# EAGLE schematic 8_bit_Left_Rev_A (EAGLE 9.6.0)

## Sheet 1 of 6: CLOCK
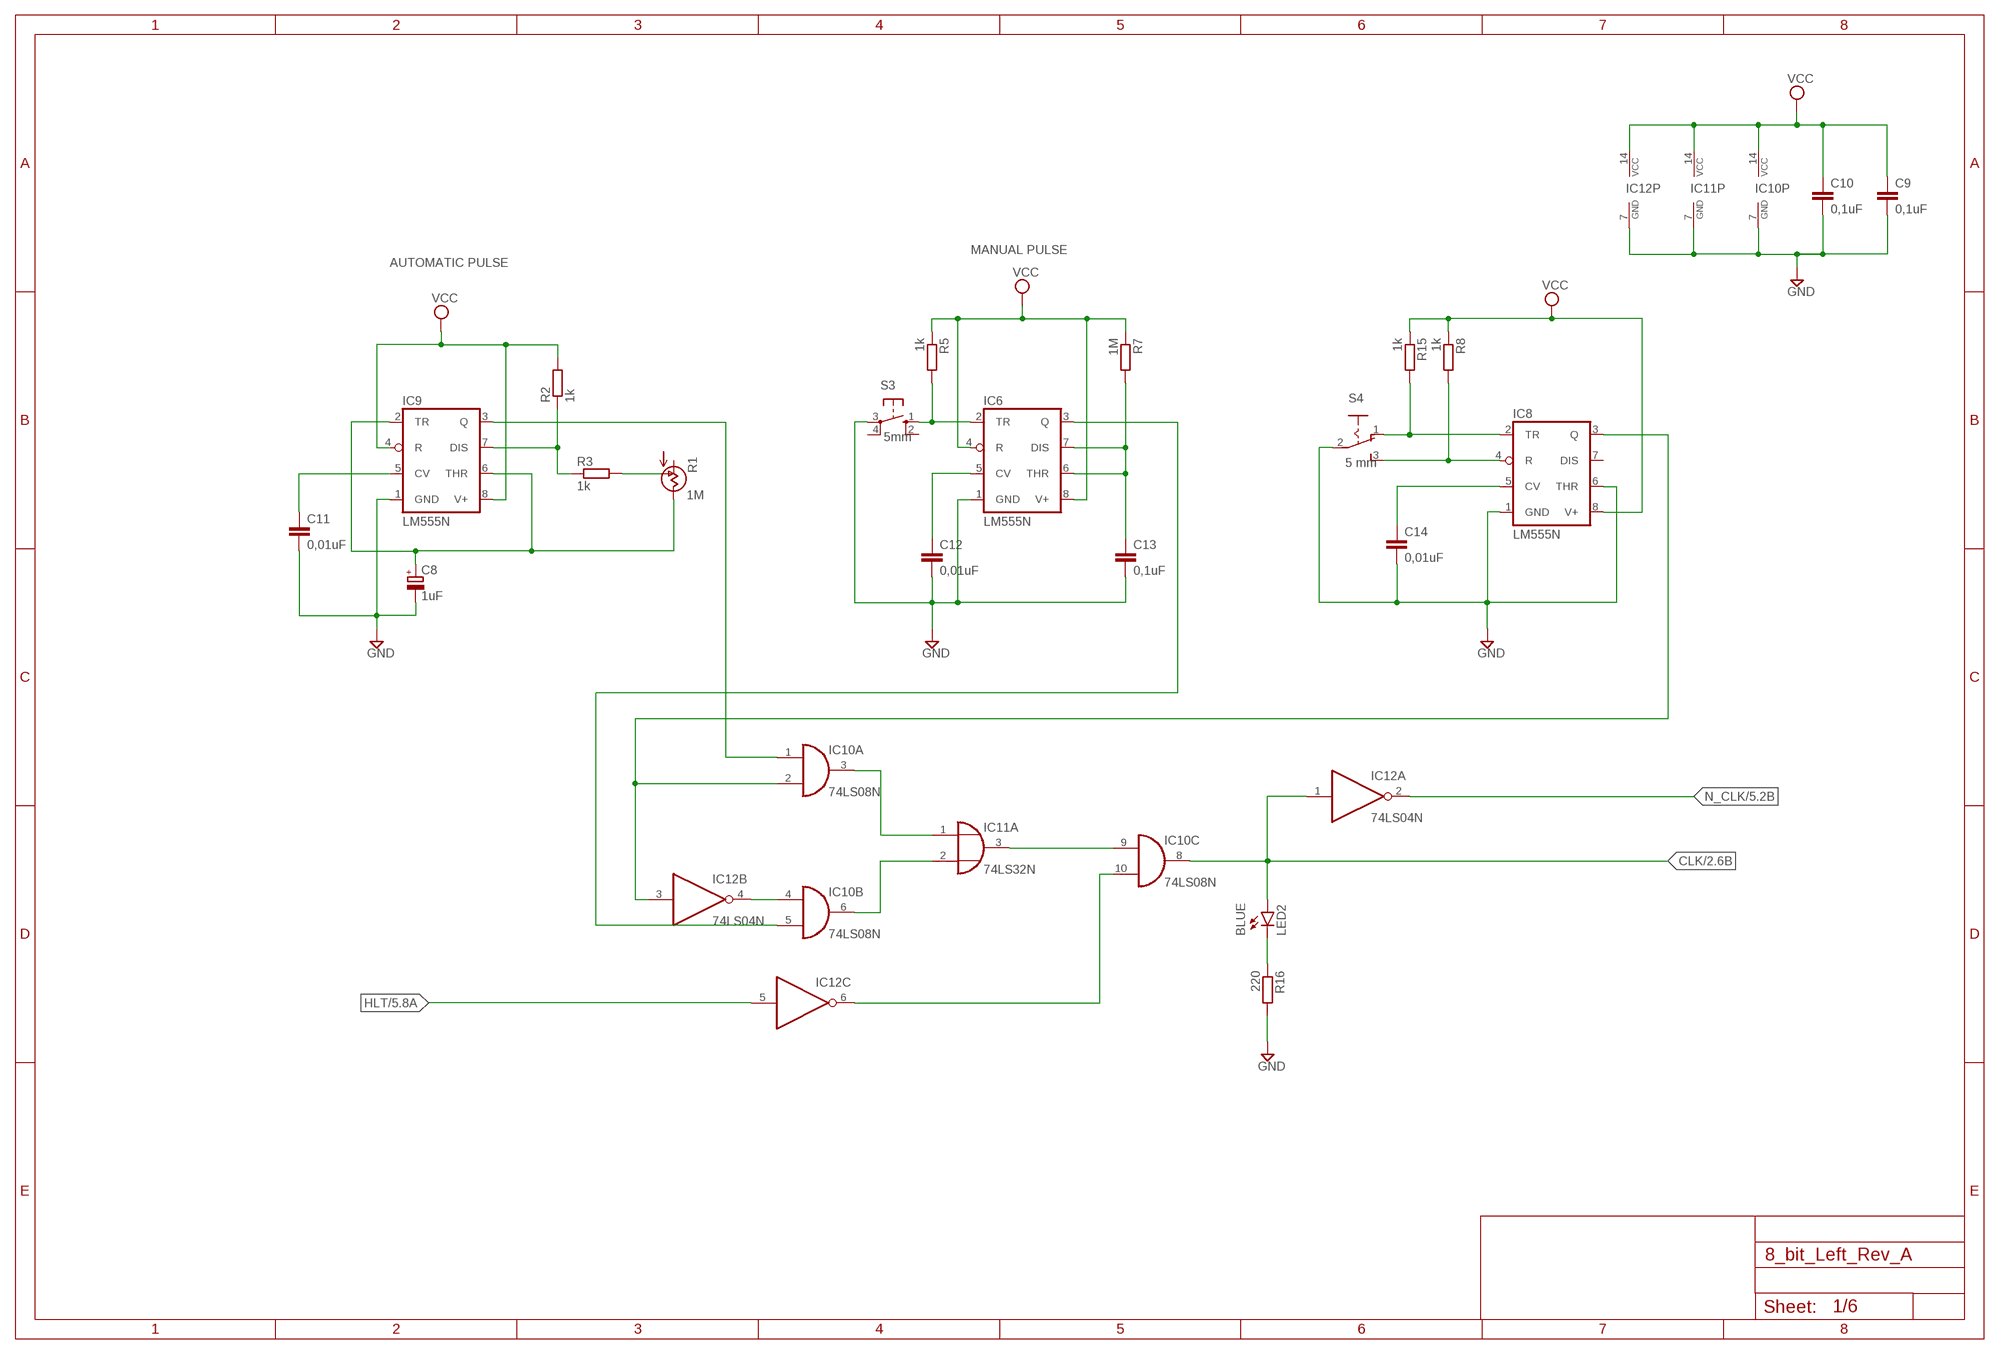
[diagram p0: schematic, sheet 1]

### Parts
C8  1uF  CPOL-EUE2-5  [E2-5]
C9  0,1uF  C-EU025-030X050  [C025-030X050]
C10  0,1uF  C-EU025-030X050  [C025-030X050]
C11  0,01uF  C-EU025-030X050  [C025-030X050]
C12  0,01uF  C-EU025-030X050  [C025-030X050]
C13  0,1uF  C-EU025-030X050  [C025-030X050]
C14  0,01uF  C-EU025-030X050  [C025-030X050]
IC6  LM555N  [DIL08]
IC8  LM555N  [DIL08]
IC9  LM555N  [DIL08]
IC10  74LS08N  [DIL14]
IC11  74LS32N  [DIL14]
IC12  74LS04N  [DIL14]
LED2  BLUE  LED5MM  [LED5MM]
R1  1M  POTTRS64W  [S64W]
R2  1k  R-EU_0207/10  [0207/10]
R3  1k  R-EU_0207/10  [0207/10]
R5  1k  R-EU_0207/10  [0207/10]
R7  1M  R-EU_0207/10  [0207/10]
R8  1k  R-EU_0207/10  [0207/10]
R15  1k  R-EU_0207/10  [0207/10]
R16  220  R-EU_0207/10  [0207/10]
S3  5mm  10-XX  [B3F-10XX]
S4  5 mm  255SB  [255SB]

### Nets
CLK: IC10.8(C:O) IC12.1(A:I) LED2.A ; also sheet 2,3,4,6
GND [zasilanie]: C8.- C9.2 C10.2 C11.2 C12.2 C13.2 C14.2 IC6.1(GND) IC8.1(GND) IC8.6(THR) IC9.1(GND) IC10.7(P:GND) IC11.7(P:GND) IC12.7(P:GND) R16.2 S3.3(P) S4.2(P) ; also sheet 2,3,4,5,6
HLT: IC12.5(C:I) ; also sheet 5
N$20: IC9.7(DIS) R2.1 R3.1
N$21: C8.+ IC9.2(TR) IC9.6(THR) R1.E(VSS)
N$22: C11.1 IC9.5(CV)
N$23: C12.1 IC6.5(CV)
N$24: C13.1 IC6.6(THR) IC6.7(DIS) R7.2
N$25: IC6.2(TR) R5.2 S3.1(S)
N$26: IC8.4(R) R8.2 S4.3(S)
N$27: IC8.2(TR) R15.2 S4.1(O)
N$28: C14.1 IC8.5(CV)
N$29: IC9.3(Q) IC10.1(A:I0)
N$30: IC6.3(Q) IC10.5(B:I1)
N$31: IC10.4(B:I0) IC12.4(B:O)
N$32: IC8.3(Q) IC10.2(A:I1) IC12.3(B:I)
N$33: IC10.3(A:O) IC11.1(A:I0)
N$34: IC10.6(B:O) IC11.2(A:I1)
N$35: IC10.9(C:I0) IC11.3(A:O)
N$36: IC10.10(C:I1) IC12.6(C:O)
N$37: R1.S(OUT) R3.2
N$38: LED2.K(C) R16.1
N_CLK: IC12.2(A:O) ; also sheet 5
VCC [zasilanie]: C9.1 C10.1 IC6.4(R) IC6.8(V+) IC8.8(V+) IC9.4(R) IC9.8(V+) IC10.14(P:VCC) IC11.14(P:VCC) IC12.14(P:VCC) R2.2 R5.1 R7.1 R8.1 R15.1 ; also sheet 2,3,4,5,6
Unconnected: IC8.7(DIS) IC10.11(D:O) IC10.12(D:I0) IC10.13(D:I1) IC11.4(B:I0) IC11.5(B:I1) IC11.6(B:O) IC11.8(C:O) IC11.9(C:I0) IC11.10(C:I1) IC11.11(D:O) IC11.12(D:I0) IC11.13(D:I1) IC12.8(D:O) IC12.9(D:I) IC12.10(E:O) IC12.11(E:I) IC12.12(F:O) IC12.13(F:I) R1.A(VDD) S3.2(S1) S3.4(P1)

### Notes on the sheet
- MANUAL PULSE
- AUTOMATIC PULSE

## Sheet 2 of 6: MAR
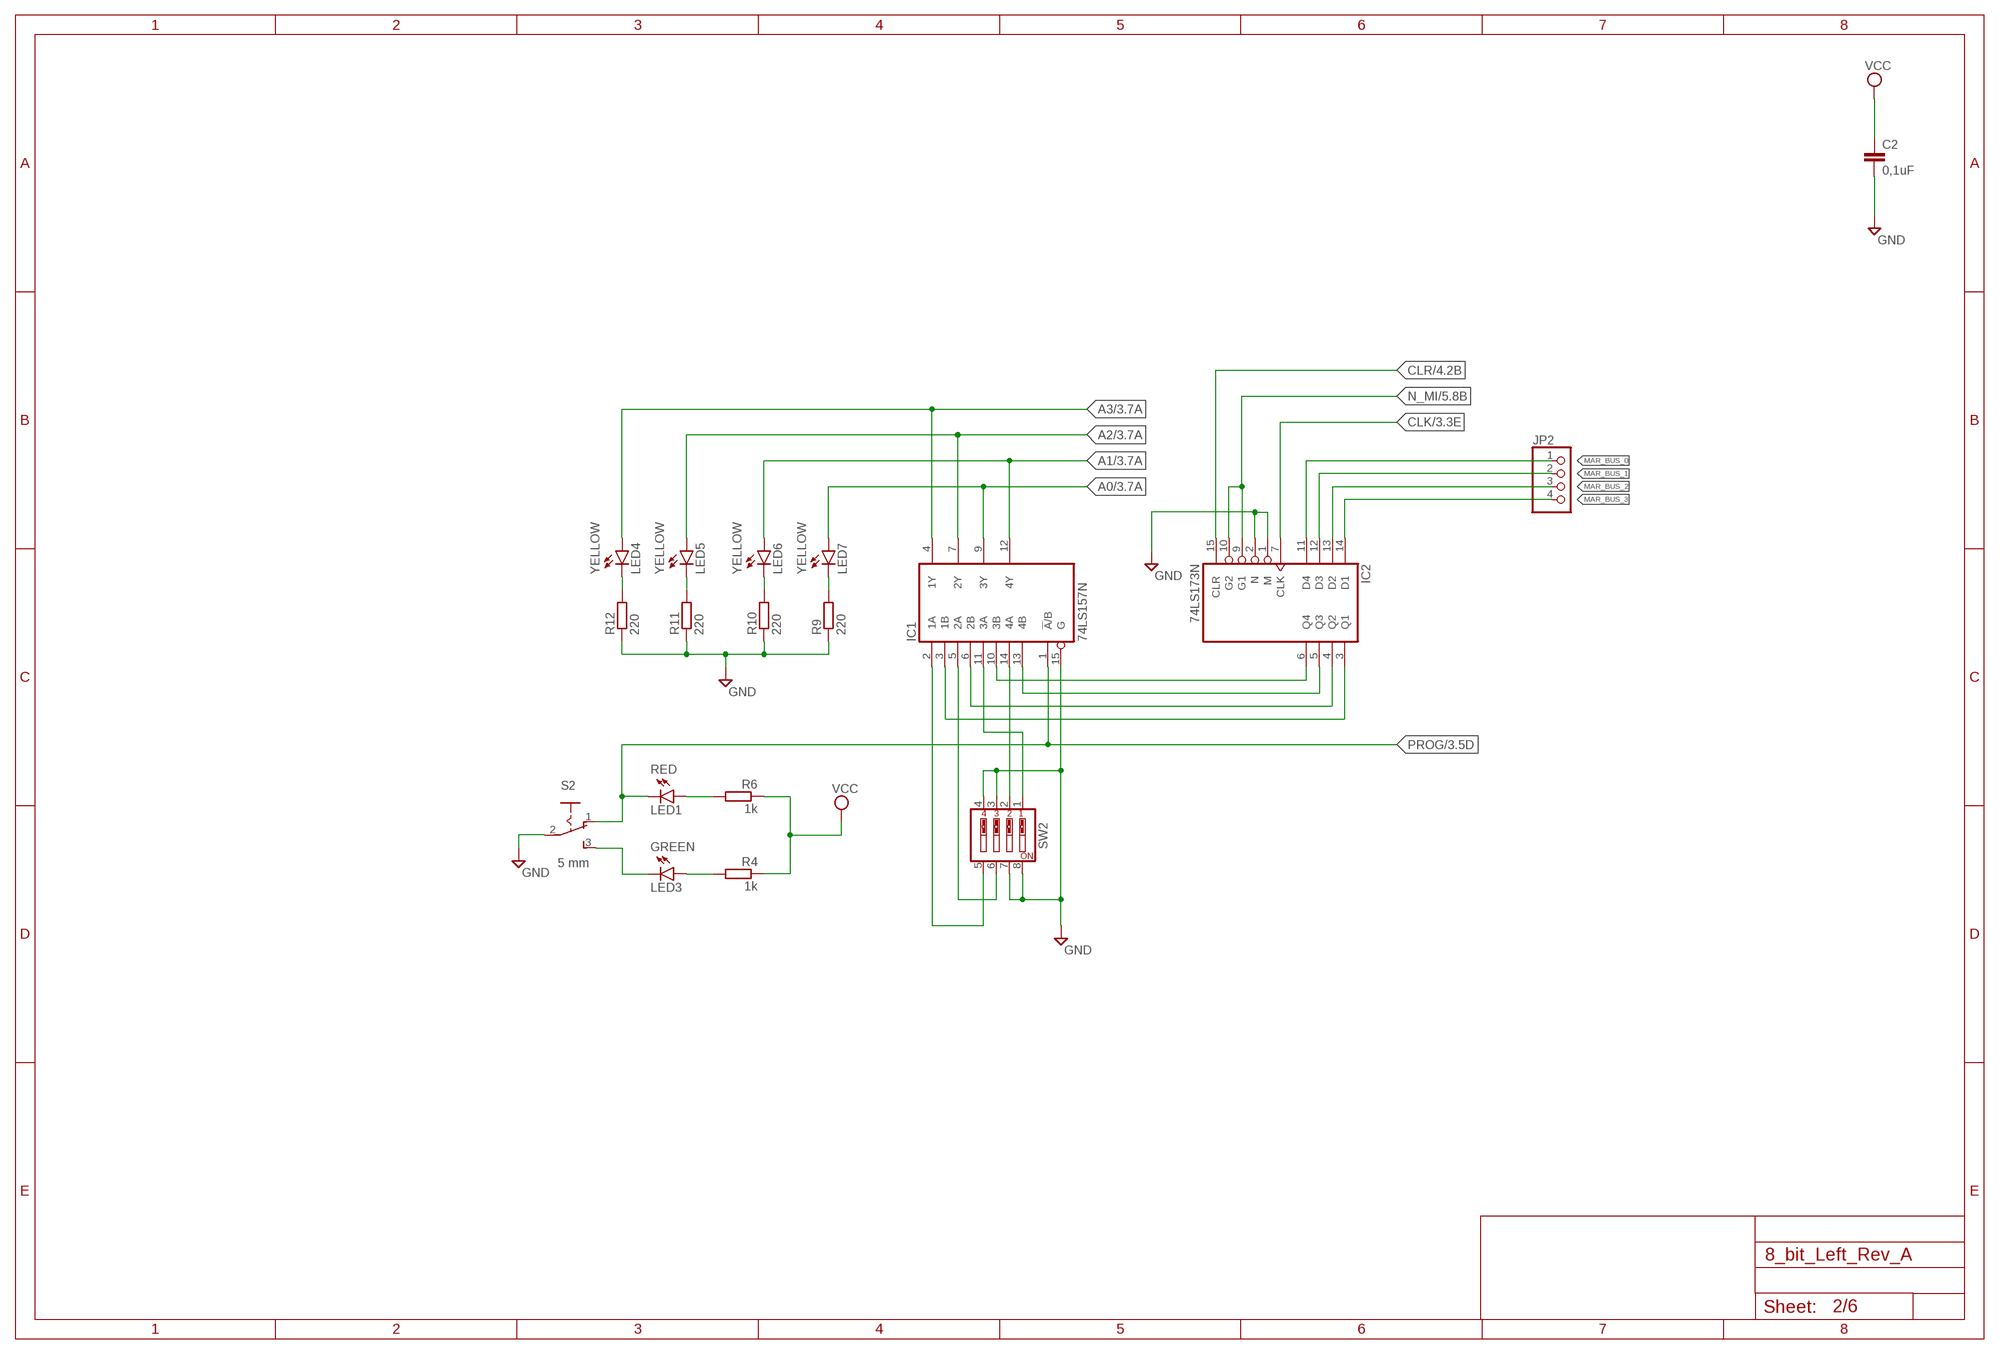
[diagram p1: schematic, sheet 2]

### Parts
C2  0,1uF  C-EU025-030X050  [C025-030X050]
IC1  74LS157N  [DIL16]
IC2  74LS173N  [DIL16]
JP2  PINHD-1X4  [1X04]
LED1  RED  LED5MM  [LED5MM]
LED3  GREEN  LED5MM  [LED5MM]
LED4  YELLOW  LED5MM  [LED5MM]
LED5  YELLOW  LED5MM  [LED5MM]
LED6  YELLOW  LED5MM  [LED5MM]
LED7  YELLOW  LED5MM  [LED5MM]
R4  1k  R-EU_0207/10  [0207/10]
R6  1k  R-EU_0207/10  [0207/10]
R9  220  R-EU_0207/10  [0207/10]
R10  220  R-EU_0207/10  [0207/10]
R11  220  R-EU_0207/10  [0207/10]
R12  220  R-EU_0207/10  [0207/10]
S2  5 mm  255SB  [255SB]
SW2  SW_DIP-4  [EDG-04]

### Nets
A0: IC1.9(3Y) LED7.A ; also sheet 3
A1: IC1.12(4Y) LED6.A ; also sheet 3
A2: IC1.7(2Y) LED5.A ; also sheet 3
A3: IC1.4(1Y) LED4.A ; also sheet 3
CLK: IC2.7(CLK) ; also sheet 1,3,4,6
CLR: IC2.15(CLR) ; also sheet 4,5
GND [zasilanie]: C2.2 IC1.15(G) IC2.1(M) IC2.2(N) R9.1 R10.1 R11.1 R12.1 S2.2(P) SW2.3 SW2.4 SW2.7 SW2.8 ; also sheet 1,3,4,5,6
GND1: LED7.K(C) R9.2
GND2: LED6.K(C) R10.2
GND3: LED5.K(C) R11.2
GND4: LED4.K(C) R12.2
MAR_BUS_0: IC2.11(D4) JP2.1
MAR_BUS_1: IC2.12(D3) JP2.2
MAR_BUS_2: IC2.13(D2) JP2.3
MAR_BUS_3: IC2.14(D1) JP2.4
N$6: LED1.A R6.2
N$7: LED3.A R4.2
N$8: LED3.K(C) S2.3(S)
N$9: IC1.14(4A) SW2.2
N$10: IC1.11(3A) SW2.1
N$11: IC1.10(3B) IC2.6(Q4)
N$12: IC1.13(4B) IC2.5(Q3)
N$13: IC1.6(2B) IC2.4(Q2)
N$14: IC1.3(1B) IC2.3(Q1)
N$15: IC1.5(2A) SW2.6
N$16: IC1.2(1A) SW2.5
N_MI: IC2.9(G1) IC2.10(G2) ; also sheet 5
PROG: IC1.1(!A!/B) LED1.K(C) S2.1(O) ; also sheet 3
VCC [zasilanie]: C2.1 R4.1 R6.1 ; also sheet 1,3,4,5,6

## Sheet 3 of 6: RAM
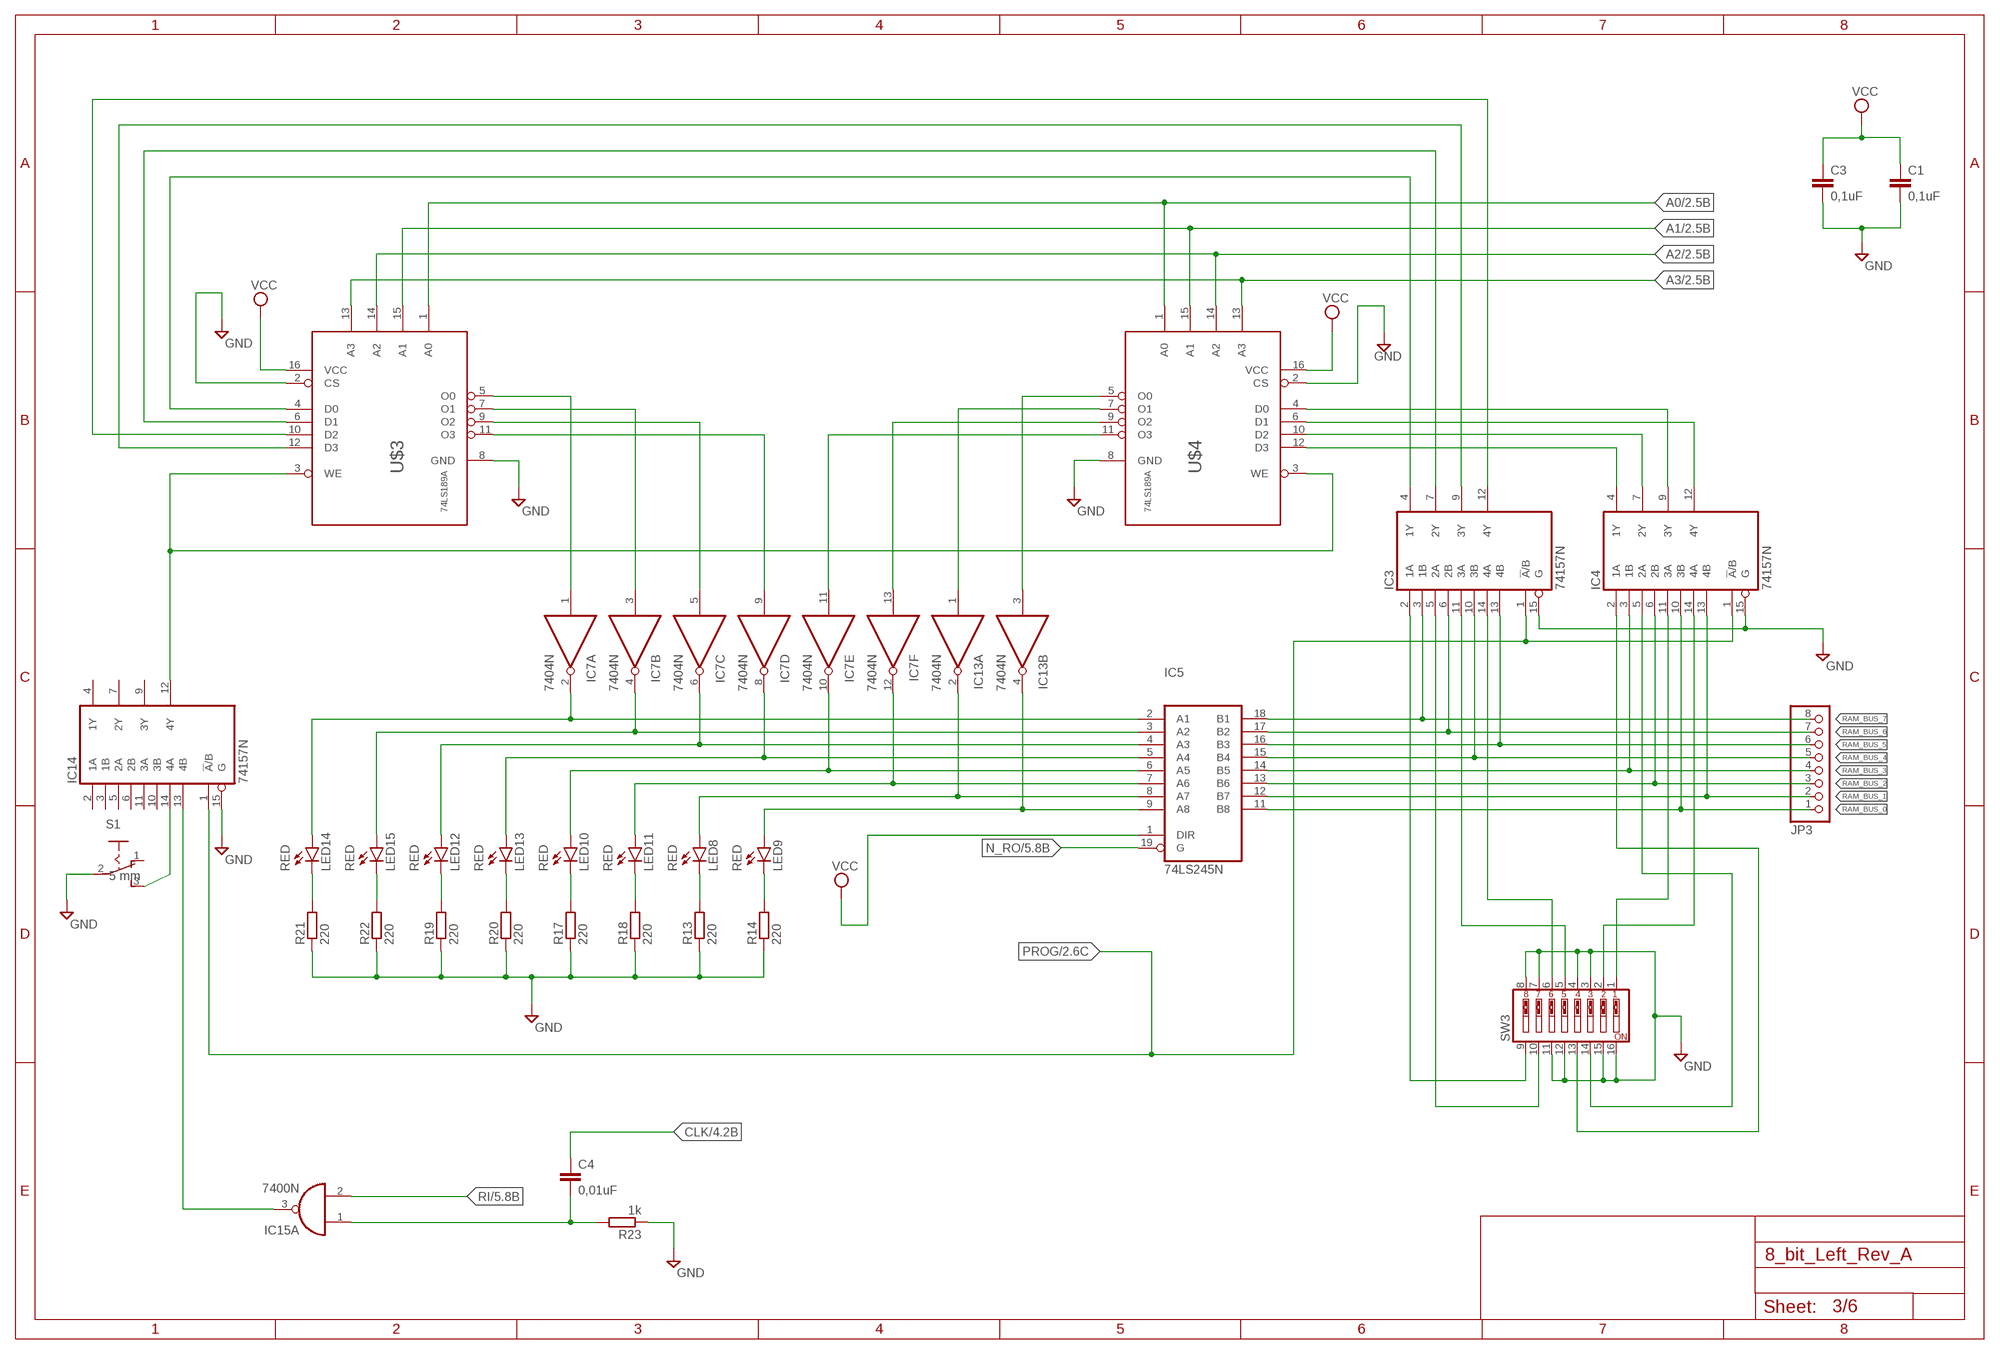
[diagram p2: schematic, sheet 3]

### Parts
C1  0,1uF  C-EU025-030X050  [C025-030X050]
C3  0,1uF  C-EU025-030X050  [C025-030X050]
C4  0,01uF  C-EU025-030X050  [C025-030X050]
IC3  74157N  [DIL16]
IC4  74157N  [DIL16]
IC5  74LS245N  [DIL20]
IC7  7404N  [DIL14]
IC13  7404N  [DIL14]
IC14  74157N  [DIL16]
IC15  7400N  [DIL14]
JP3  PINHD-1X8  [1X08]
LED8  RED  LED5MM  [LED5MM]
LED9  RED  LED5MM  [LED5MM]
LED10  RED  LED5MM  [LED5MM]
LED11  RED  LED5MM  [LED5MM]
LED12  RED  LED5MM  [LED5MM]
LED13  RED  LED5MM  [LED5MM]
LED14  RED  LED5MM  [LED5MM]
LED15  RED  LED5MM  [LED5MM]
R13  220  R-EU_0207/10  [0207/10]
R14  220  R-EU_0207/10  [0207/10]
R17  220  R-EU_0207/10  [0207/10]
R18  220  R-EU_0207/10  [0207/10]
R19  220  R-EU_0207/10  [0207/10]
R20  220  R-EU_0207/10  [0207/10]
R21  220  R-EU_0207/10  [0207/10]
R22  220  R-EU_0207/10  [0207/10]
R23  1k  R-EU_0207/10  [0207/10]
S1  5 mm  255SB  [255SB]
SW3  SW_DIP-8  [EDG-08]
U$3  74LS189A  [74LS189]
U$4  74LS189A  [74LS189]

### Nets
A0: U$3.1(A0) U$4.1(A0) ; also sheet 2
A1: U$3.15(A1) U$4.15(A1) ; also sheet 2
A2: U$3.14(A2) U$4.14(A2) ; also sheet 2
A3: U$3.13(A3) U$4.13(A3) ; also sheet 2
CLK: C4.1 ; also sheet 1,2,4,6
GND [zasilanie]: C1.2 C3.2 IC3.15(G) IC4.15(G) IC14.15(G) R13.1 R14.1 R17.1 R18.1 R19.1 R20.1 R21.1 R22.1 R23.1 S1.2(P) SW3.3 SW3.4 SW3.7 SW3.8 SW3.11 SW3.12 SW3.15 SW3.16 U$3.2(CS) U$3.8(GND) U$4.2(CS) U$4.8(GND) ; also sheet 1,2,4,5,6
GND5: LED8.K(C) R13.2
GND6: LED9.K(C) R14.2
GND7: LED10.K(C) R17.2
GND8: LED11.K(C) R18.2
GND9: LED12.K(C) R19.2
GND10: LED13.K(C) R20.2
GND11: LED14.K(C) R21.2
GND12: LED15.K(C) R22.2
N$2: IC3.4(1Y) U$3.4(D0)
N$3: IC3.7(2Y) U$3.6(D1)
N$4: IC3.9(3Y) U$3.12(D3)
N$5: IC3.12(4Y) U$3.10(D2)
N$17: IC14.12(4Y) U$3.3(WE) U$4.3(WE)
N$18: IC13.3(B:I) U$4.5(O0)
N$19: IC13.1(A:I) U$4.7(O1)
N$39: IC7.13(F:I) U$4.9(O2)
N$40: IC7.11(E:I) U$4.11(O3)
N$41: IC7.1(A:I) U$3.5(O0)
N$42: IC7.3(B:I) U$3.7(O1)
N$43: IC7.5(C:I) U$3.9(O2)
N$44: IC7.9(D:I) U$3.11(O3)
N$45: IC5.2(A1) IC7.2(A:O) LED14.A
N$46: IC5.3(A2) IC7.4(B:O) LED15.A
N$47: IC5.4(A3) IC7.6(C:O) LED12.A
N$48: IC5.5(A4) IC7.8(D:O) LED13.A
N$49: IC5.6(A5) IC7.10(E:O) LED10.A
N$50: IC5.7(A6) IC7.12(F:O) LED11.A
N$51: IC5.8(A7) IC13.2(A:O) LED8.A
N$52: IC5.9(A8) IC13.4(B:O) LED9.A
N$53: IC14.14(4A) S1.3(S)
N$54: IC14.13(4B) IC15.3(A:O)
N$55: C4.2 IC15.1(A:I0) R23.2
N$56: IC3.2(1A) SW3.9
N$57: IC3.5(2A) SW3.10
N$58: IC3.11(3A) SW3.5
N$59: IC3.14(4A) SW3.6
N$60: IC4.14(4A) SW3.2
N$61: IC4.5(2A) SW3.14
N$62: IC4.11(3A) SW3.1
N$63: IC4.2(1A) SW3.13
N$64: IC4.9(3Y) U$4.4(D0)
N$65: IC4.4(1Y) U$4.12(D3)
N$66: IC4.7(2Y) U$4.10(D2)
N$67: IC4.12(4Y) U$4.6(D1)
N_RO: IC5.19(G) ; also sheet 5
PROG: IC3.1(!A!/B) IC4.1(!A!/B) IC14.1(!A!/B) ; also sheet 2
RAM_BUS_0: IC4.10(3B) IC5.11(B8) JP3.1
RAM_BUS_1: IC4.13(4B) IC5.12(B7) JP3.2
RAM_BUS_2: IC4.6(2B) IC5.13(B6) JP3.3
RAM_BUS_3: IC4.3(1B) IC5.14(B5) JP3.4
RAM_BUS_4: IC3.10(3B) IC5.15(B4) JP3.5
RAM_BUS_5: IC3.13(4B) IC5.16(B3) JP3.6
RAM_BUS_6: IC3.6(2B) IC5.17(B2) JP3.7
RAM_BUS_7: IC3.3(1B) IC5.18(B1) JP3.8
RI: IC15.2(A:I1) ; also sheet 5
VCC [zasilanie]: C1.1 C3.1 IC5.1(DIR) U$3.16(VCC) U$4.16(VCC) ; also sheet 1,2,4,5,6
Unconnected: IC13.5(C:I) IC13.6(C:O) IC13.8(D:O) IC13.9(D:I) IC13.10(E:O) IC13.11(E:I) IC13.12(F:O) IC13.13(F:I) IC14.2(1A) IC14.3(1B) IC14.4(1Y) IC14.5(2A) IC14.6(2B) IC14.7(2Y) IC14.9(3Y) IC14.10(3B) IC14.11(3A) IC15.4(B:I0) IC15.5(B:I1) IC15.6(B:O) IC15.8(C:O) IC15.9(C:I0) IC15.10(C:I1) IC15.11(D:O) IC15.12(D:I0) IC15.13(D:I1) S1.1(O)

## Sheet 4 of 6: INSTRUCTION REGISTER
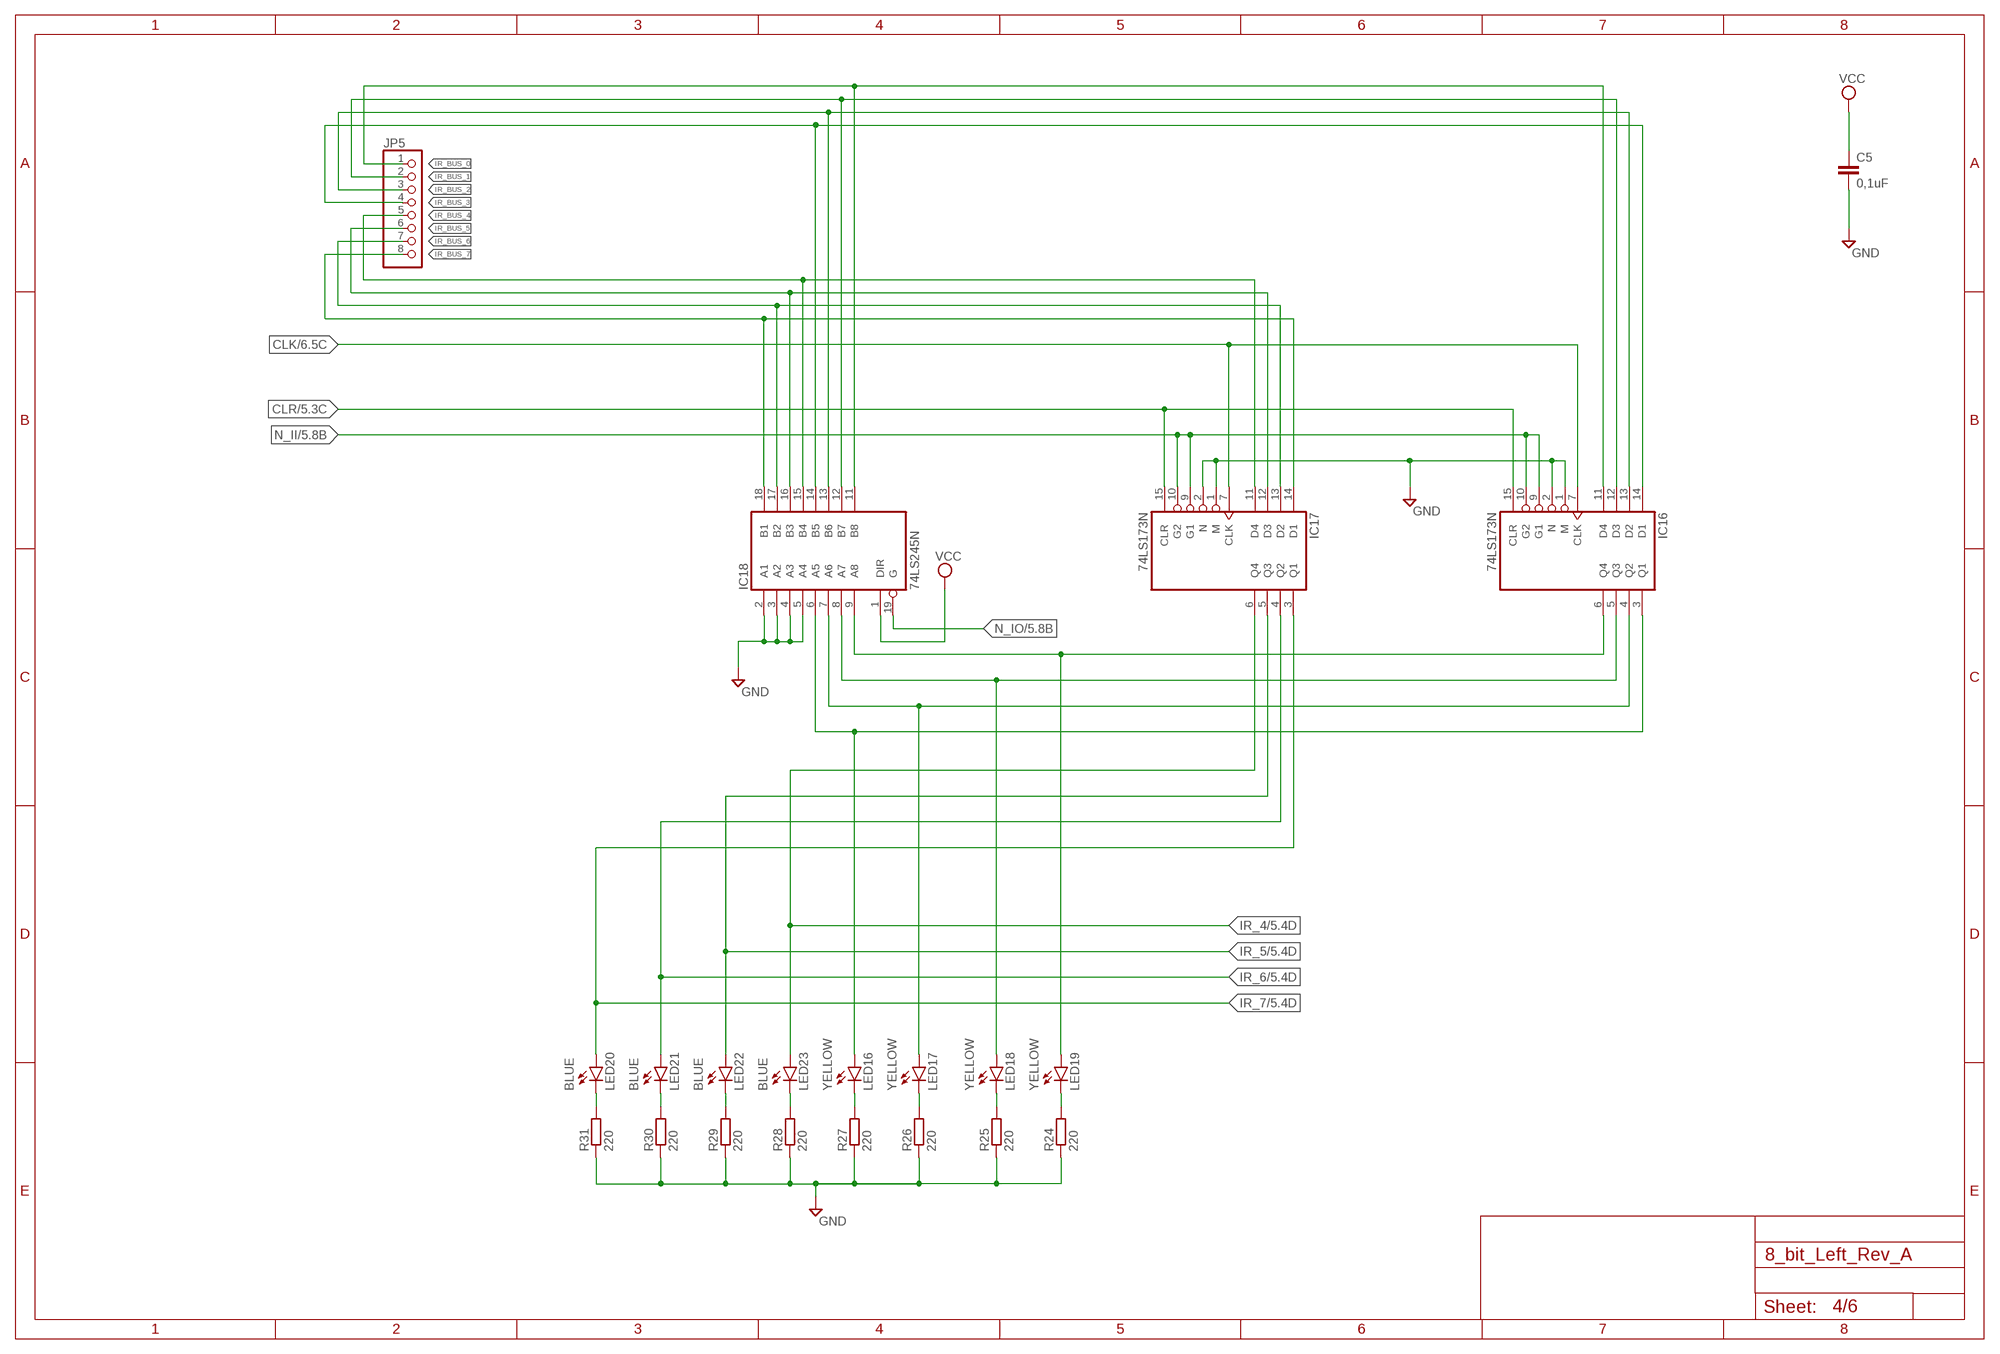
[diagram p3: schematic, sheet 4]

### Parts
C5  0,1uF  C-EU025-030X050  [C025-030X050]
IC16  74LS173N  [DIL16]
IC17  74LS173N  [DIL16]
IC18  74LS245N  [DIL20]
JP5  PINHD-1X8  [1X08]
LED16  YELLOW  LED5MM  [LED5MM]
LED17  YELLOW  LED5MM  [LED5MM]
LED18  YELLOW  LED5MM  [LED5MM]
LED19  YELLOW  LED5MM  [LED5MM]
LED20  BLUE  LED5MM  [LED5MM]
LED21  BLUE  LED5MM  [LED5MM]
LED22  BLUE  LED5MM  [LED5MM]
LED23  BLUE  LED5MM  [LED5MM]
R24  220  R-EU_0207/10  [0207/10]
R25  220  R-EU_0207/10  [0207/10]
R26  220  R-EU_0207/10  [0207/10]
R27  220  R-EU_0207/10  [0207/10]
R28  220  R-EU_0207/10  [0207/10]
R29  220  R-EU_0207/10  [0207/10]
R30  220  R-EU_0207/10  [0207/10]
R31  220  R-EU_0207/10  [0207/10]

### Nets
CLK: IC16.7(CLK) IC17.7(CLK) ; also sheet 1,2,3,6
CLR: IC16.15(CLR) IC17.15(CLR) ; also sheet 2,5
GND [zasilanie]: C5.2 IC16.1(M) IC16.2(N) IC17.1(M) IC17.2(N) IC18.2(A1) IC18.3(A2) IC18.4(A3) IC18.5(A4) R24.1 R25.1 R26.1 R27.1 R28.1 R29.1 R30.1 R31.1 ; also sheet 1,2,3,5,6
GND15: LED19.K(C) R24.2
GND16: LED18.K(C) R25.2
GND17: LED17.K(C) R26.2
GND18: LED16.K(C) R27.2
GND19: LED23.K(C) R28.2
GND20: LED22.K(C) R29.2
GND21: LED21.K(C) R30.2
GND22: LED20.K(C) R31.2
IR_4: IC17.6(Q4) LED23.A ; also sheet 5
IR_5: IC17.5(Q3) LED22.A ; also sheet 5
IR_6: IC17.4(Q2) LED21.A ; also sheet 5
IR_7: IC17.3(Q1) LED20.A ; also sheet 5
IR_BUS_0: IC16.11(D4) IC18.11(B8) JP5.1
IR_BUS_1: IC16.12(D3) IC18.12(B7) JP5.2
IR_BUS_2: IC16.13(D2) IC18.13(B6) JP5.3
IR_BUS_3: IC16.14(D1) IC18.14(B5) JP5.4
IR_BUS_4: IC17.11(D4) IC18.15(B4) JP5.5
IR_BUS_5: IC17.12(D3) IC18.16(B3) JP5.6
IR_BUS_6: IC17.13(D2) IC18.17(B2) JP5.7
IR_BUS_7: IC17.14(D1) IC18.18(B1) JP5.8
N$68: IC16.6(Q4) IC18.9(A8) LED19.A
N$69: IC16.5(Q3) IC18.8(A7) LED18.A
N$70: IC16.4(Q2) IC18.7(A6) LED17.A
N$71: IC16.3(Q1) IC18.6(A5) LED16.A
N_II: IC16.9(G1) IC16.10(G2) IC17.9(G1) IC17.10(G2) ; also sheet 5
N_IO: IC18.19(G) ; also sheet 5
VCC [zasilanie]: C5.1 IC18.1(DIR) ; also sheet 1,2,3,5,6

## Sheet 5 of 6: CONTROL WORD
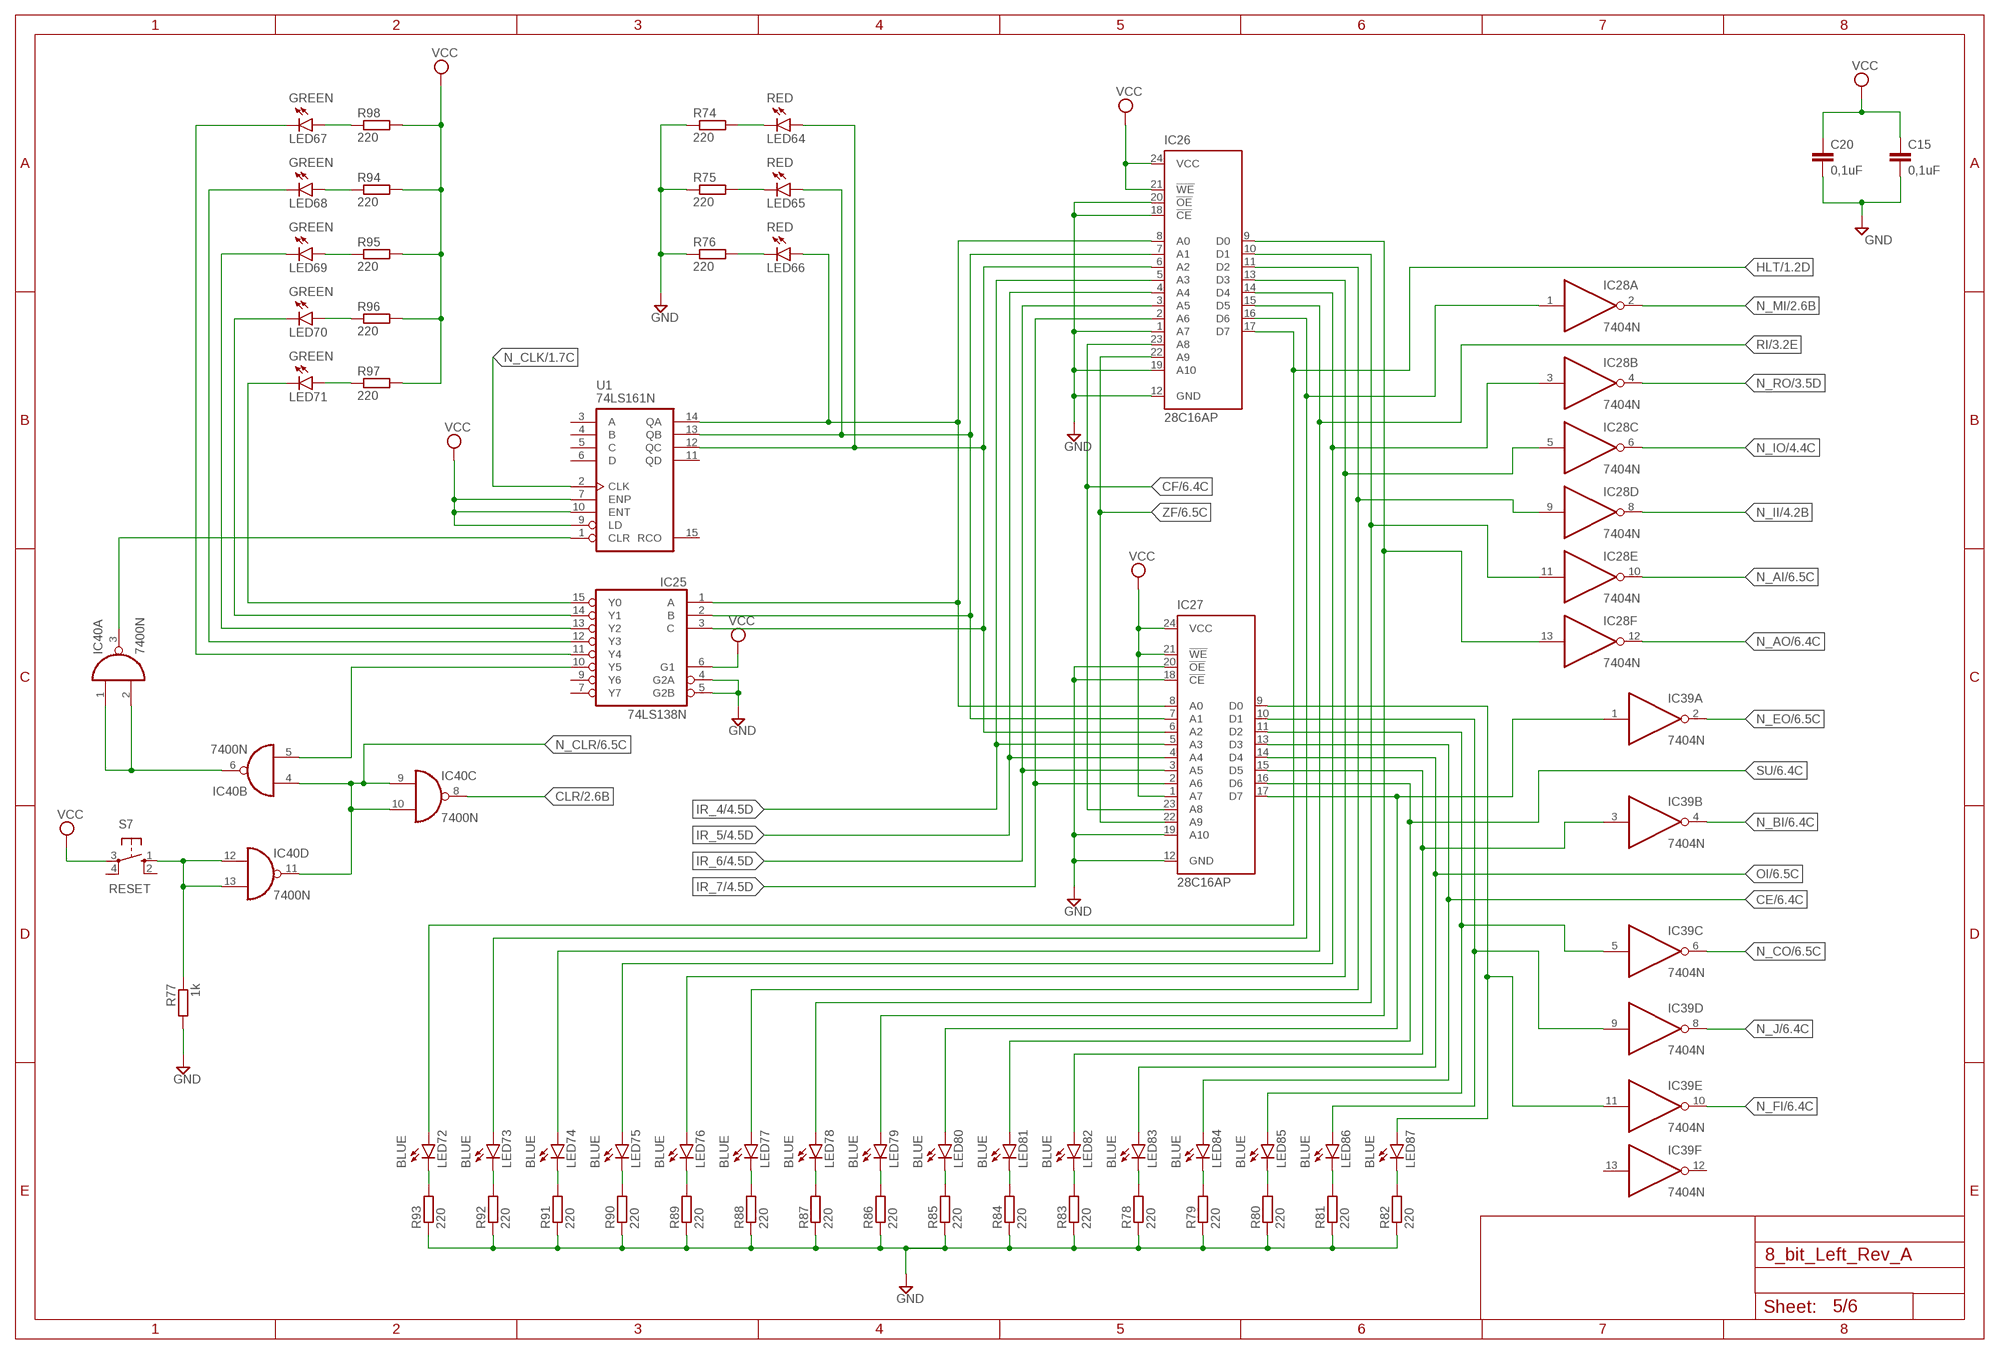
[diagram p4: schematic, sheet 5]

### Parts
C15  0,1uF  C-EU025-030X050  [C025-030X050]
C20  0,1uF  C-EU025-030X050  [C025-030X050]
IC25  74LS138N  [DIL16]
IC26  28C16AP  [DIL24-6]
IC27  28C16AP  [DIL24-6]
IC28  7404N  [DIL14]
IC39  7404N  [DIL14]
IC40  7400N  [DIL14]
LED64  RED  LED5MM  [LED5MM]
LED65  RED  LED5MM  [LED5MM]
LED66  RED  LED5MM  [LED5MM]
LED67  GREEN  LED5MM  [LED5MM]
LED68  GREEN  LED5MM  [LED5MM]
LED69  GREEN  LED5MM  [LED5MM]
LED70  GREEN  LED5MM  [LED5MM]
LED71  GREEN  LED5MM  [LED5MM]
LED72  BLUE  LED5MM  [LED5MM]
LED73  BLUE  LED5MM  [LED5MM]
LED74  BLUE  LED5MM  [LED5MM]
LED75  BLUE  LED5MM  [LED5MM]
LED76  BLUE  LED5MM  [LED5MM]
LED77  BLUE  LED5MM  [LED5MM]
LED78  BLUE  LED5MM  [LED5MM]
LED79  BLUE  LED5MM  [LED5MM]
LED80  BLUE  LED5MM  [LED5MM]
LED81  BLUE  LED5MM  [LED5MM]
LED82  BLUE  LED5MM  [LED5MM]
LED83  BLUE  LED5MM  [LED5MM]
LED84  BLUE  LED5MM  [LED5MM]
LED85  BLUE  LED5MM  [LED5MM]
LED86  BLUE  LED5MM  [LED5MM]
LED87  BLUE  LED5MM  [LED5MM]
R74  220  R-EU_0207/10  [0207/10]
R75  220  R-EU_0207/10  [0207/10]
R76  220  R-EU_0207/10  [0207/10]
R77  1k  R-EU_0207/10  [0207/10]
R78  220  R-EU_0207/10  [0207/10]
R79  220  R-EU_0207/10  [0207/10]
R80  220  R-EU_0207/10  [0207/10]
R81  220  R-EU_0207/10  [0207/10]
R82  220  R-EU_0207/10  [0207/10]
R83  220  R-EU_0207/10  [0207/10]
R84  220  R-EU_0207/10  [0207/10]
R85  220  R-EU_0207/10  [0207/10]
R86  220  R-EU_0207/10  [0207/10]
R87  220  R-EU_0207/10  [0207/10]
R88  220  R-EU_0207/10  [0207/10]
R89  220  R-EU_0207/10  [0207/10]
R90  220  R-EU_0207/10  [0207/10]
R91  220  R-EU_0207/10  [0207/10]
R92  220  R-EU_0207/10  [0207/10]
R93  220  R-EU_0207/10  [0207/10]
R94  220  R-EU_0207/10  [0207/10]
R95  220  R-EU_0207/10  [0207/10]
R96  220  R-EU_0207/10  [0207/10]
R97  220  R-EU_0207/10  [0207/10]
R98  220  R-EU_0207/10  [0207/10]
S7  RESET  10-XX  [B3F-10XX]
U1  74LS161N  [DIL16]

### Nets
ASD1: IC25.10(Y5) IC40.5(B:I1)
CE: IC27.13(D3) LED84.A ; also sheet 6
CF: IC26.23(A8) IC27.23(A8) ; also sheet 6
CLK4: IC25.1(A) IC26.8(A0) IC27.8(A0) LED66.A U1.14(QA)
CLK5: IC25.2(B) IC26.7(A1) IC27.7(A1) LED65.A U1.13(QB)
CLK6: IC25.3(C) IC26.6(A2) IC27.6(A2) LED64.A U1.12(QC)
CLR: IC40.8(C:O) ; also sheet 2,4
GND [zasilanie]: C15.2 C20.2 IC25.4(G2A) IC25.5(G2B) IC26.1(A7) IC26.12(GND) IC26.18(!CE) IC26.19(A10) IC26.20(!OE) IC27.12(GND) IC27.18(!CE) IC27.19(A10) IC27.20(!OE) R74.1 R75.1 R76.1 R77.2 R78.1 R79.1 R80.1 R81.1 R82.1 R83.1 R84.1 R85.1 R86.1 R87.1 R88.1 R89.1 R90.1 R91.1 R92.1 R93.1 ; also sheet 1,2,3,4,6
GND61: LED64.K(C) R74.2
GND62: LED65.K(C) R75.2
GND63: LED66.K(C) R76.2
GND64: IC25.12(Y3) LED68.K(C)
GND65: IC25.13(Y2) LED69.K(C)
GND66: IC25.14(Y1) LED70.K(C)
GND67: IC25.15(Y0) LED71.K(C)
GND68: IC25.11(Y4) LED67.K(C)
GND69: LED83.K(C) R78.2
GND70: LED84.K(C) R79.2
GND71: LED85.K(C) R80.2
GND72: LED86.K(C) R81.2
GND73: LED87.K(C) R82.2
GND74: LED82.K(C) R83.2
GND75: LED81.K(C) R84.2
GND76: LED80.K(C) R85.2
GND77: LED79.K(C) R86.2
GND78: LED78.K(C) R87.2
GND79: LED77.K(C) R88.2
GND80: LED76.K(C) R89.2
GND81: LED75.K(C) R90.2
GND82: LED74.K(C) R91.2
GND83: LED73.K(C) R92.2
GND84: LED72.K(C) R93.2
HLT: IC26.17(D7) LED72.A ; also sheet 1
IR_4: IC26.5(A3) IC27.5(A3) ; also sheet 4
IR_5: IC26.4(A4) IC27.4(A4) ; also sheet 4
IR_6: IC26.3(A5) IC27.3(A5) ; also sheet 4
IR_7: IC26.2(A6) IC27.2(A6) ; also sheet 4
N$129: IC40.1(A:I0) IC40.2(A:I1) IC40.6(B:O)
N$130: IC40.3(A:O) U1.1(CLR)
N$131: IC40.12(D:I0) IC40.13(D:I1) R77.1 S7.1(S)
N$132: IC26.14(D4) IC28.3(B:I) LED75.A
N$133: IC26.13(D3) IC28.5(C:I) LED76.A
N$134: IC26.11(D2) IC28.9(D:I) LED77.A
N$135: IC26.10(D1) IC28.11(E:I) LED78.A
N$136: IC26.9(D0) IC28.13(F:I) LED79.A
N$137: IC27.17(D7) IC39.1(A:I) LED80.A
N$138: IC27.15(D5) IC39.3(B:I) LED82.A
N$139: IC27.11(D2) IC39.5(C:I) LED85.A
N$140: IC27.10(D1) IC39.9(D:I) LED86.A
N$141: IC27.9(D0) IC39.11(E:I) LED87.A
N$142: LED69.A R95.1
N$143: LED68.A R94.1
N$144: LED70.A R96.1
N$145: LED67.A R98.1
N$146: LED71.A R97.1
N_AI: IC28.10(E:O) ; also sheet 6
N_AO: IC28.12(F:O) ; also sheet 6
N_BI: IC39.4(B:O) ; also sheet 6
N_CLK: U1.2(CLK) ; also sheet 1
N_CLR: IC40.4(B:I0) IC40.9(C:I0) IC40.10(C:I1) IC40.11(D:O) ; also sheet 6
N_CO: IC39.6(C:O) ; also sheet 6
N_EO: IC39.2(A:O) ; also sheet 6
N_FI: IC39.10(E:O) ; also sheet 6
N_II: IC28.8(D:O) ; also sheet 4
N_IO: IC28.6(C:O) ; also sheet 4
N_J: IC39.8(D:O) ; also sheet 6
N_MI: IC28.2(A:O) ; also sheet 2
N_RO: IC28.4(B:O) ; also sheet 3
OI: IC27.14(D4) LED83.A ; also sheet 6
QWER1: IC26.16(D6) IC28.1(A:I) LED73.A
RI: IC26.15(D5) LED74.A ; also sheet 3
SU: IC27.16(D6) LED81.A ; also sheet 6
VCC [zasilanie]: C15.1 C20.1 IC25.6(G1) IC26.21(!WE) IC26.24(VCC) IC27.1(A7) IC27.21(!WE) IC27.24(VCC) R94.2 R95.2 R96.2 R97.2 R98.2 S7.3(P) U1.7(ENP) U1.9(LD) U1.10(ENT) ; also sheet 1,2,3,4,6
ZF: IC26.22(A9) IC27.22(A9) ; also sheet 6
Unconnected: IC25.7(Y7) IC25.9(Y6) IC39.12(F:O) IC39.13(F:I) S7.2(S1) S7.4(P1) U1.3(A) U1.4(B) U1.5(C) U1.6(D) U1.11(QD) U1.15(RCO)

## Sheet 6 of 6: Stuff
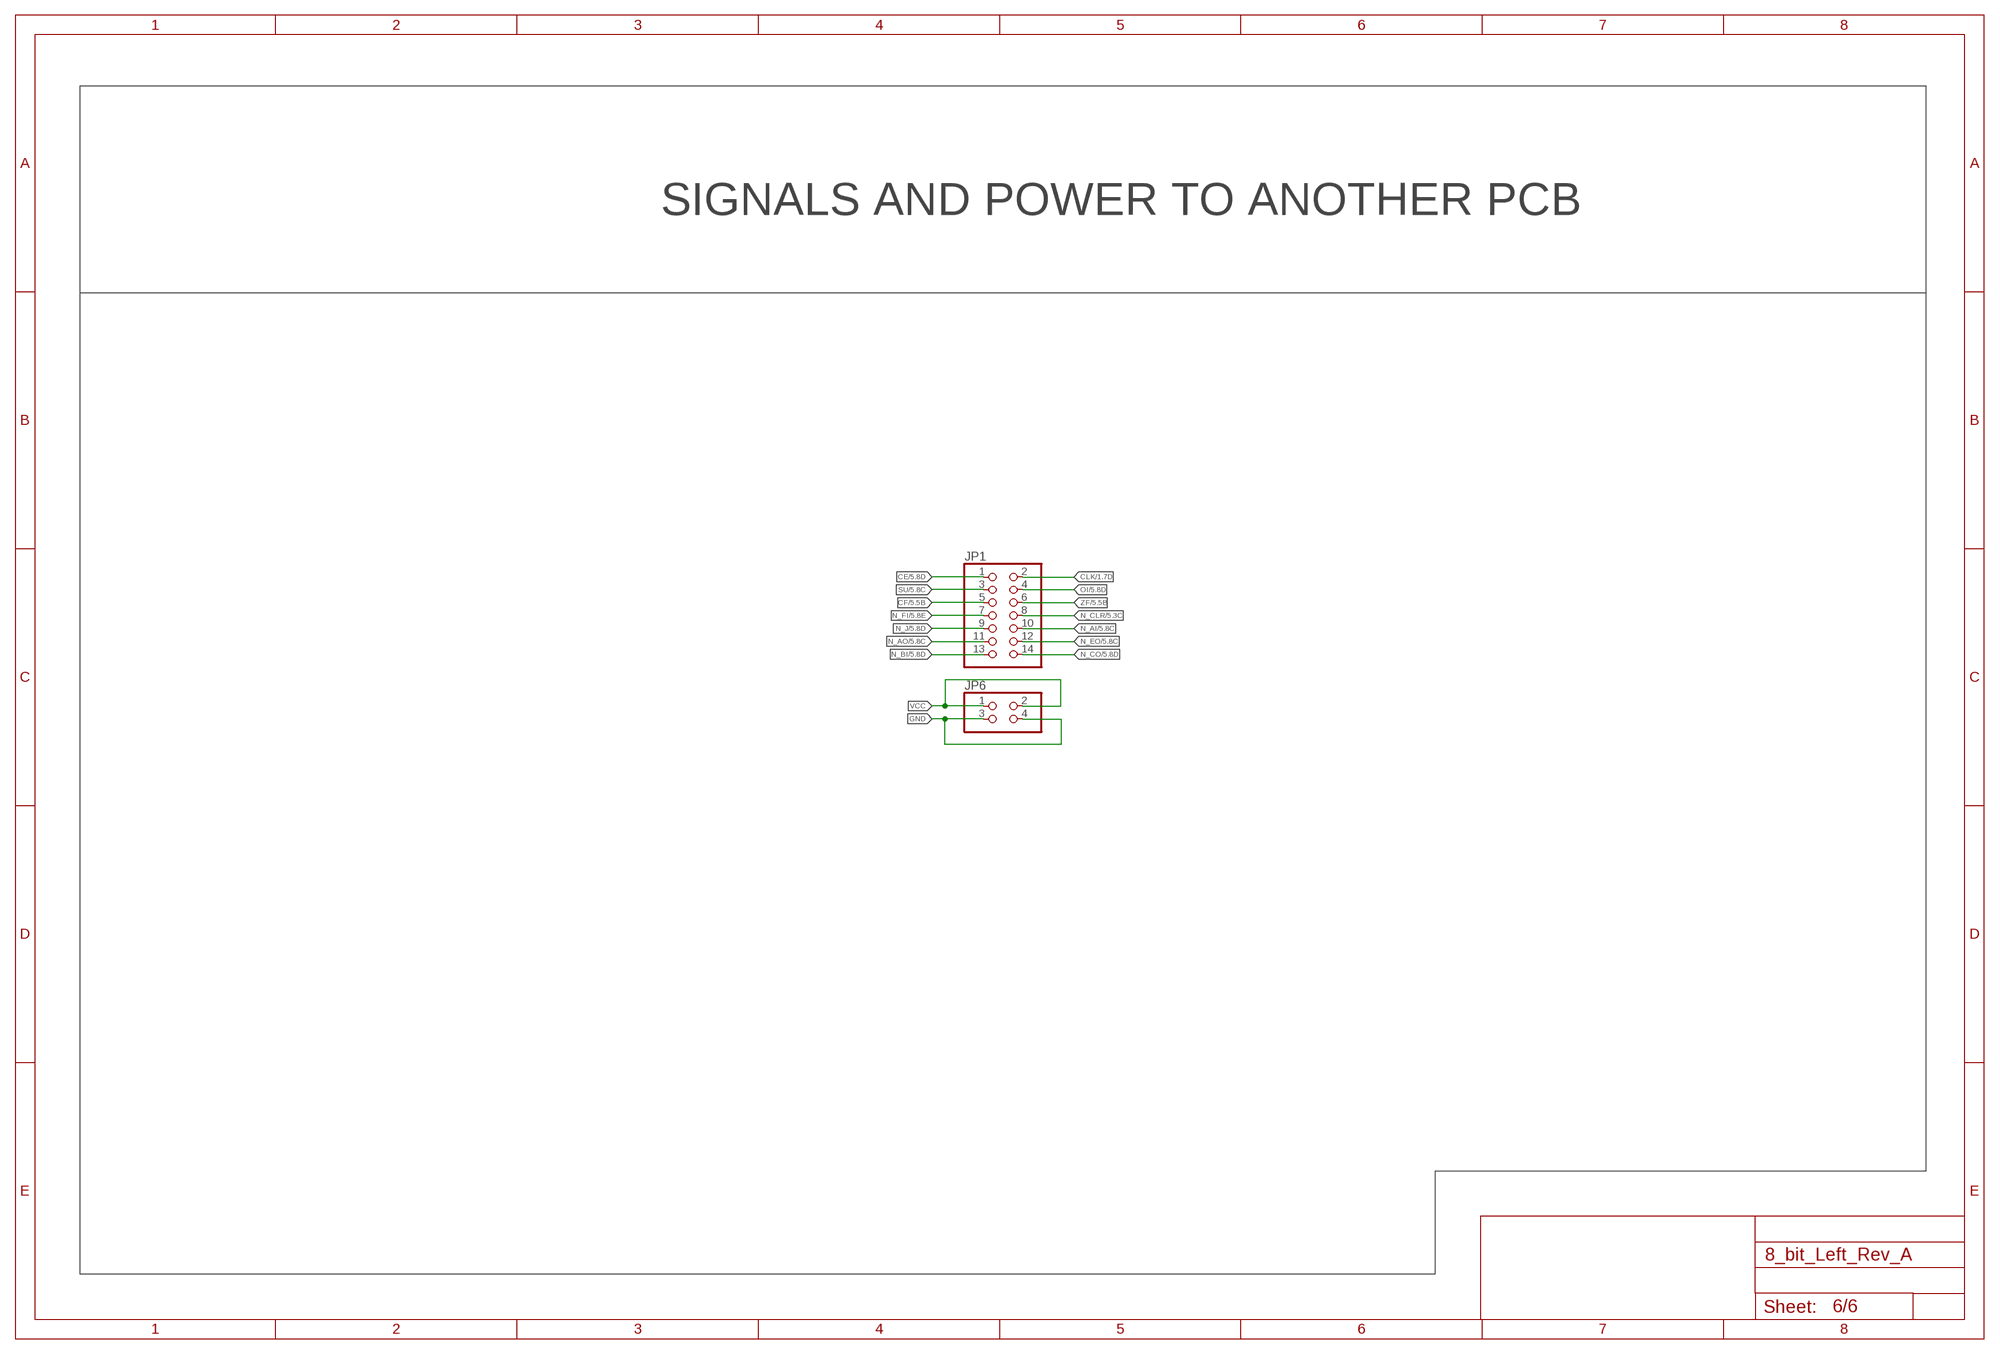
[diagram p5: schematic, sheet 6]

### Parts
JP1  PINHD-2X7  [2X07]
JP6  PINHD-2X2  [2X02]

### Nets
CE: JP1.1 ; also sheet 5
CF: JP1.5 ; also sheet 5
CLK: JP1.2 ; also sheet 1,2,3,4
GND [zasilanie]: JP6.3 JP6.4 ; also sheet 1,2,3,4,5
N_AI: JP1.10 ; also sheet 5
N_AO: JP1.11 ; also sheet 5
N_BI: JP1.13 ; also sheet 5
N_CLR: JP1.8 ; also sheet 5
N_CO: JP1.14 ; also sheet 5
N_EO: JP1.12 ; also sheet 5
N_FI: JP1.7 ; also sheet 5
N_J: JP1.9 ; also sheet 5
OI: JP1.4 ; also sheet 5
SU: JP1.3 ; also sheet 5
VCC [zasilanie]: JP6.1 JP6.2 ; also sheet 1,2,3,4,5
ZF: JP1.6 ; also sheet 5

### Notes on the sheet
- SIGNALS AND POWER TO ANOTHER PCB

## Power pins joined to a net without a drawn wire
GND: IC1.8(GND) IC2.8(GND) IC3.8(GND) IC4.8(GND) IC5.10(GND) IC7.7(P:GND) IC13.7(P:GND) IC14.8(GND) IC15.7(P:GND) IC16.8(GND) IC17.8(GND) IC18.10(GND) IC25.8(GND) IC28.7(P:GND) IC39.7(P:GND) IC40.7(P:GND) U1.8(GND)
VCC: IC1.16(VCC) IC2.16(VCC) IC3.16(VCC) IC4.16(VCC) IC5.20(VCC) IC7.14(P:VCC) IC13.14(P:VCC) IC14.16(VCC) IC15.14(P:VCC) IC16.16(VCC) IC17.16(VCC) IC18.20(VCC) IC25.16(VCC) IC28.14(P:VCC) IC39.14(P:VCC) IC40.14(P:VCC) U1.16(VCC)

## Library data of the parts
C1-C5 C9-C15 C20 = rcl:C-EU: CAPACITOR, European symbol; SPICEPREFIX: C
C8 = rcl:CPOL-EU: POLARIZED CAPACITOR, European symbol; SPICEPREFIX: C
IC1 IC3 IC4 IC14 = 74xx-eu:74*157: Quadruple 2-line to 1-line data SELECTOR/MULTIPLEXER
IC2 IC16 IC17 = 74xx-eu:74*173: 4-bit D type REGISTER, 3-state
IC5 IC18 = 74xx-eu:74*245: Octal BUS TRANSCEIVER, 3-state
IC6 IC8 IC9 = linear:*555: TIMER
IC7 IC12 IC13 IC28 IC39 = 74xx-eu:74*04: Hex INVERTER
IC10 = 74xx-eu:74*08: Quad 2-input AND gate
IC11 = 74xx-eu:74*32: Quad 2-input OR gate
IC15 IC40 = 74xx-eu:74*00: Quad 2-input NAND gate
IC25 = 74xx-eu:74*138: 3-line to 8-line DECODER/DEMULTIPLEXER
IC26 IC27 = microchip:28*16A: CMOS EPROM 16 K (2 K x 8) Source: ww1.microchip.com/downloads/en/DeviceDoc/11125J.pdf; MPN: CAT28C16ALI-12; OC_FARNELL: 1718292; OC_NEWARK: 06R0648
JP1 = pinhead:PINHD-2X7: PIN HEADER
JP2 = pinhead:PINHD-1X4: PIN HEADER
JP3 JP5 = pinhead:PINHD-1X8: PIN HEADER
JP6 = pinhead:PINHD-2X2: PIN HEADER
LED1-LED23 LED64-LED87 = led:LED: LED OSRAM: - CHIPLED LG R971, LG N971, LY N971, LG Q971, LY Q971, LO R971, LY R971 LH N974, LH R974 LS Q976, LO Q976, LY Q976 LO Q996 - Hyper CHIPLED LW Q18S LB Q993, LB Q99A, LB R99A - SideLED LS A670, LO A670, LY A670, LG A670, LP A670 LB A673, LV A673, LT A673, LW A673 LH A674 LY A675 LS A676, LA A676, LO A676, LY A676, LW A676 LS A679, LY A679, LG A679 - Hyper Micro SIDELED® LS Y876, LA Y876, LO Y876, LY Y876 LT Y87S - SmartLED LW L88C, LW L88S LB L89C, LB L89S, LG L890 LS L89K, LO L89K, LY L89K LS L896, LA L896, LO L896, LY L896 - TOPLED LS T670, LO T670, LY T670, LG T670, LP T670 LSG T670, LSP T670, LSY T670, LOP T670, LYG T670 LG T671, LOG T671, LSG T671 LB T673, LV T673, LT T673, LW T673 LH T674 LS T676, LA T676, LO T676, LY T676, LB T676, LH T676, LSB T676, LW T676 LB T67C, LV T67C, LT T67C, LS T67K, LO T67K, LY T67K, LW E67C LS E67B, LA E67B, LO E67B, LY E67B, LB E67C, LV E67C, LT E67C LW T67C LS T679, LY T679, LG T679 LS T770, LO T770, LY T770, LG T770, LP T770 LB T773, LV T773, LT T773, LW T773 LH T774 LS E675, LA E675, LY E675, LS T675 LS T776, LA T776, LO T776, LY T776, LB T776 LHGB T686 LT T68C, LB T68C - Hyper Mini TOPLED® LB M676 - Mini TOPLED Santana® LG M470 LS M47K, LO M47K, LY M47K Source: http://www.osram.convergy.de LUXEON: - LUMILED® LXK2-PW12-R00, LXK2-PW12-S00, LXK2-PW14-U00, LXK2-PW14-V00 LXK2-PM12-R00, LXK2-PM12-S00, LXK2-PM14-U00 LXK2-PE12-Q00, LXK2-PE12-R00, LXK2-PE12-S00, LXK2-PE14-T00, LXK2-PE14-U00 LXK2-PB12-K00, LXK2-PB12-L00, LXK2-PB12-M00, LXK2-PB14-N00, LXK2-PB14-P00, LXK2-PB14-Q00 LXK2-PR12-L00, LXK2-PR12-M00, LXK2-PR14-Q00, LXK2-PR14-R00 LXK2-PD12-Q00, LXK2-PD12-R00, LXK2-PD12-S00 LXK2-PH12-R00, LXK2-PH12-S00 LXK2-PL12-P00, LXK2-PL12-Q00, LXK2-PL12-R00 Source: www.luxeon.com KINGBRIGHT: KA-3528ASYC Source: www.kingbright.com
R1 = lm555:POTTR: POTENTIOMETER; R9: 1M
R2-R31 R74-R98 = rcl:R-EU_: RESISTOR, European symbol; SPICEPREFIX: R
S1 S2 S4 = switch:255SB: SLIDING SWITCH Distributor Buerklin, 11G810
S3 S7 = switch-omron:10-XX: OMRON SWITCH; MPN: B3F-1000; OC_FARNELL: 176432; OC_NEWARK: 36M3542
SW2 = special:SW_DIP-4: DIP SWITCH
SW3 = special:SW_DIP-8: DIP SWITCH
U1 = oldchips:74*161: Synchronous 4-bit COUNTER with direct clear
U$3 U$4 = 74xx189:74LS189

## Net classes
1 zasilanie: width 0.508 mm